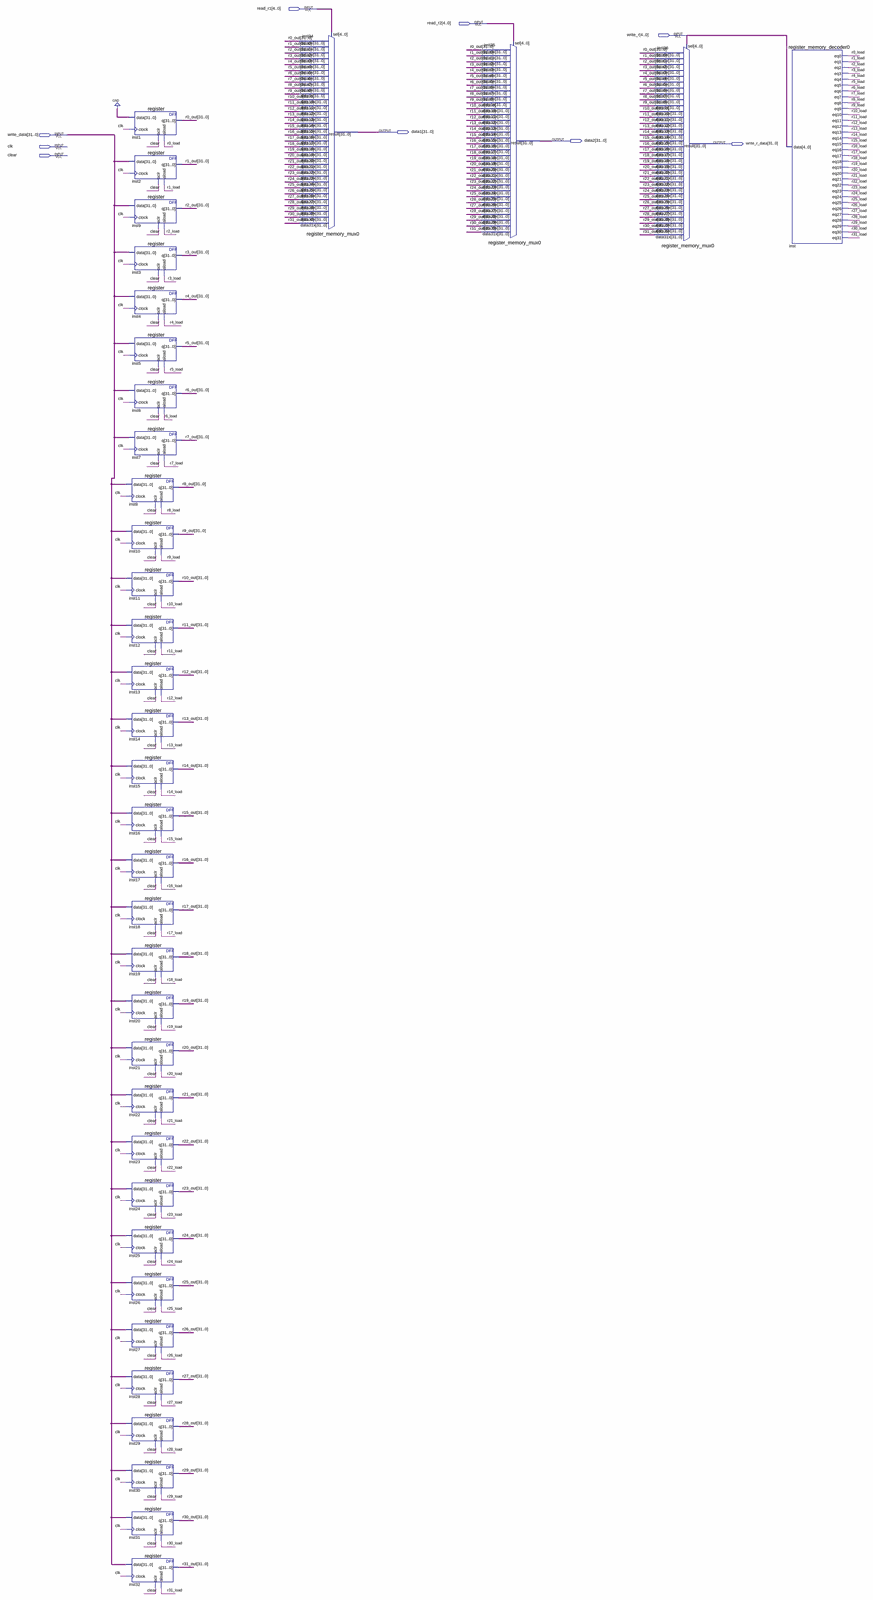
[diagram p0: schematic sheet, whole]
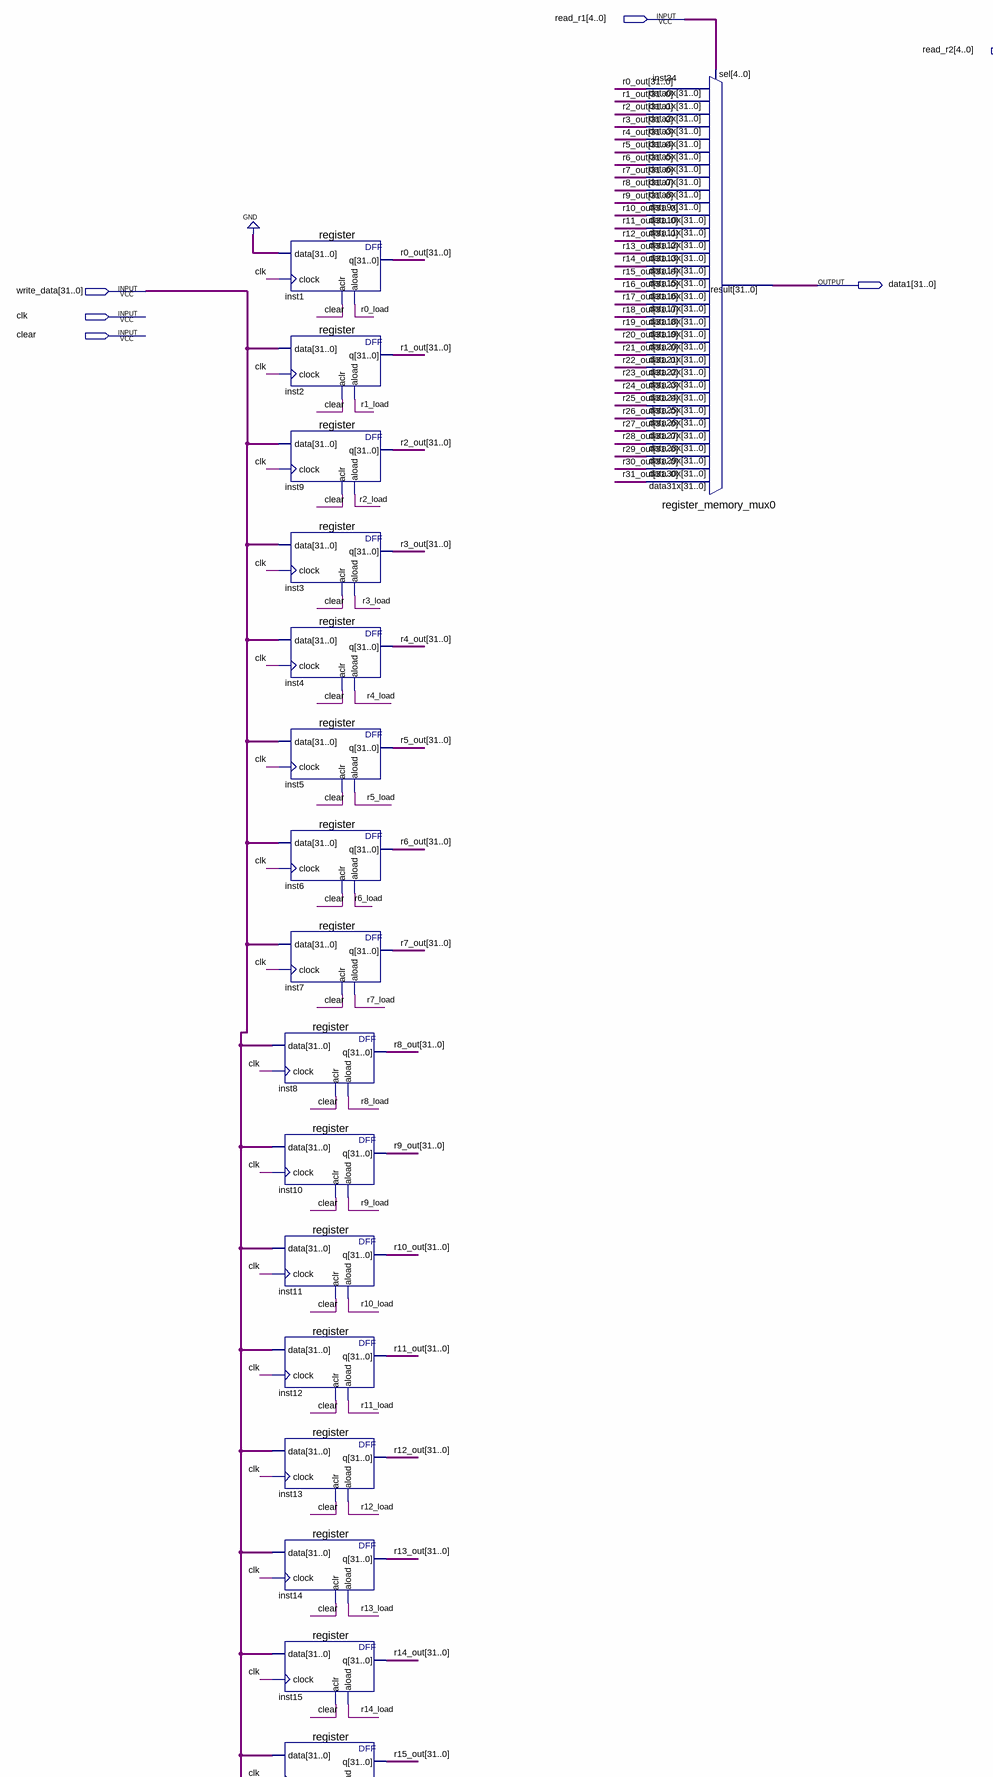
[diagram p1: schematic sheet, upper left part]
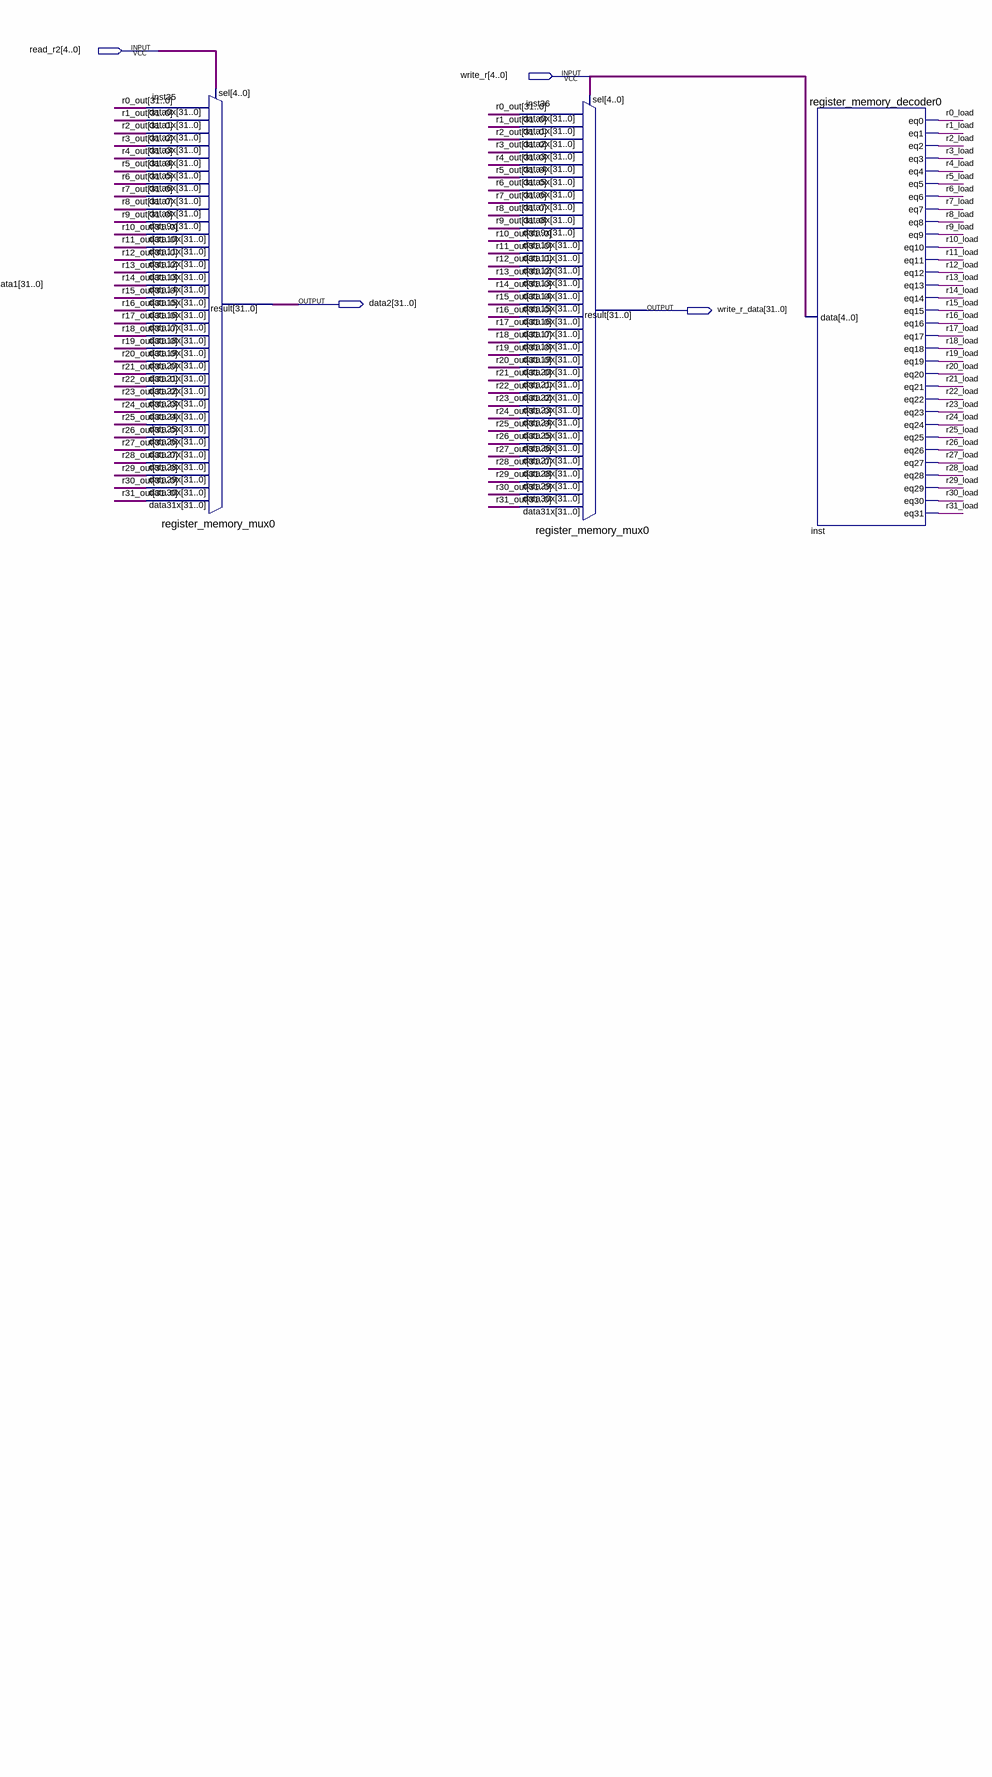
[diagram p2: schematic sheet, upper right part]
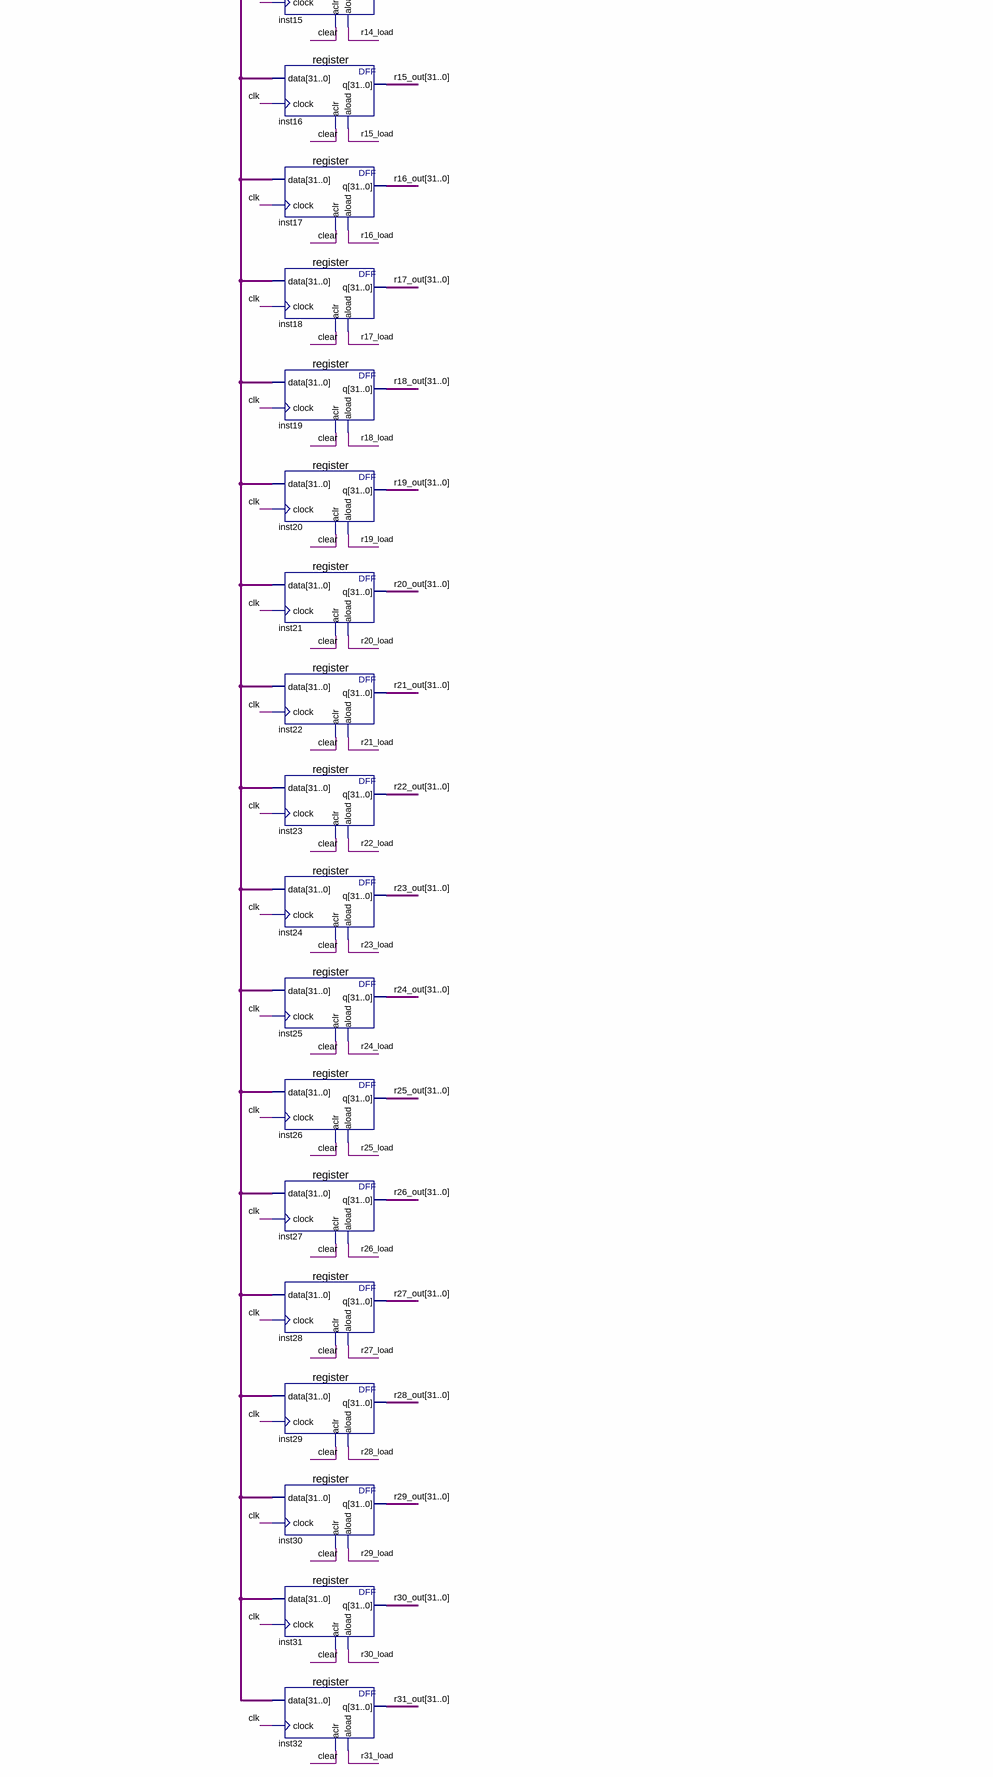
[diagram p3: schematic sheet, lower left part]
// Quartus schematic Register_Memory.bdf as structural Verilog: 36 symbols, 9 pins
module Register_Memory (
  input  [4:0] read_r1,
  input  [4:0] read_r2,
  input  [4:0] write_r,
  input  [31:0] write_data,
  input  clk,
  input  clear,
  output [31:0] data1,
  output [31:0] data2,
  output [31:0] write_r_data
);

  wire r0_load, r1_load, r2_load, r3_load, r4_load, r5_load, r6_load, r7_load, r8_load, r9_load, r10_load,
       r11_load, r12_load, r13_load, r14_load, r15_load, r16_load, r17_load, r18_load, r19_load, r20_load,
       r21_load, r22_load, r23_load, r24_load, r25_load, r26_load, r27_load, r28_load, r29_load, r30_load,
       r31_load;
  wire [31:0] r0_out, r1_out, r2_out, r3_out, r4_out, r5_out, r6_out, r7_out, r8_out, r9_out, r10_out,
       r11_out, r12_out, r13_out, r14_out, r15_out, r16_out, r17_out, r18_out, r19_out, r20_out, r21_out,
       r22_out, r23_out, r24_out, r25_out, r26_out, r27_out, r28_out, r29_out, r30_out, r31_out;

  register inst1 (.data({32{1'b0}}), .clock(clk), .aclr(clear), .aload(r0_load), .q(r0_out));
  register inst2 (.data(write_data), .clock(clk), .aclr(clear), .aload(r1_load), .q(r1_out));
  register inst9 (.data(write_data), .clock(clk), .aclr(clear), .aload(r2_load), .q(r2_out));
  register inst3 (.data(write_data), .clock(clk), .aclr(clear), .aload(r3_load), .q(r3_out));
  register inst4 (.data(write_data), .clock(clk), .aclr(clear), .aload(r4_load), .q(r4_out));
  register inst5 (.data(write_data), .clock(clk), .aclr(clear), .aload(r5_load), .q(r5_out));
  register inst6 (.data(write_data), .clock(clk), .aclr(clear), .aload(r6_load), .q(r6_out));
  register inst7 (.data(write_data), .clock(clk), .aclr(clear), .aload(r7_load), .q(r7_out));
  register inst8 (.data(write_data), .clock(clk), .aclr(clear), .aload(r8_load), .q(r8_out));
  register inst10 (.data(write_data), .clock(clk), .aclr(clear), .aload(r9_load), .q(r9_out));
  register inst11 (.data(write_data), .clock(clk), .aclr(clear), .aload(r10_load), .q(r10_out));
  register inst12 (.data(write_data), .clock(clk), .aclr(clear), .aload(r11_load), .q(r11_out));
  register inst13 (.data(write_data), .clock(clk), .aclr(clear), .aload(r12_load), .q(r12_out));
  register inst14 (.data(write_data), .clock(clk), .aclr(clear), .aload(r13_load), .q(r13_out));
  register inst15 (.data(write_data), .clock(clk), .aclr(clear), .aload(r14_load), .q(r14_out));
  register inst16 (.data(write_data), .clock(clk), .aclr(clear), .aload(r15_load), .q(r15_out));
  register inst17 (.data(write_data), .clock(clk), .aclr(clear), .aload(r16_load), .q(r16_out));
  register inst18 (.data(write_data), .clock(clk), .aclr(clear), .aload(r17_load), .q(r17_out));
  register inst19 (.data(write_data), .clock(clk), .aclr(clear), .aload(r18_load), .q(r18_out));
  register inst20 (.data(write_data), .clock(clk), .aclr(clear), .aload(r19_load), .q(r19_out));
  register inst21 (.data(write_data), .clock(clk), .aclr(clear), .aload(r20_load), .q(r20_out));
  register inst22 (.data(write_data), .clock(clk), .aclr(clear), .aload(r21_load), .q(r21_out));
  register inst23 (.data(write_data), .clock(clk), .aclr(clear), .aload(r22_load), .q(r22_out));
  register inst24 (.data(write_data), .clock(clk), .aclr(clear), .aload(r23_load), .q(r23_out));
  register inst25 (.data(write_data), .clock(clk), .aclr(clear), .aload(r24_load), .q(r24_out));
  register inst26 (.data(write_data), .clock(clk), .aclr(clear), .aload(r25_load), .q(r25_out));
  register inst27 (.data(write_data), .clock(clk), .aclr(clear), .aload(r26_load), .q(r26_out));
  register inst28 (.data(write_data), .clock(clk), .aclr(clear), .aload(r27_load), .q(r27_out));
  register inst29 (.data(write_data), .clock(clk), .aclr(clear), .aload(r28_load), .q(r28_out));
  register inst30 (.data(write_data), .clock(clk), .aclr(clear), .aload(r29_load), .q(r29_out));
  register inst31 (.data(write_data), .clock(clk), .aclr(clear), .aload(r30_load), .q(r30_out));
  register inst32 (.data(write_data), .clock(clk), .aclr(clear), .aload(r31_load), .q(r31_out));
  register_memory_mux0 inst34 (
    .data31x(r31_out), .data30x(r30_out), .data29x(r29_out), .data28x(r28_out), .data27x(r27_out),
    .data26x(r26_out), .data25x(r25_out), .data24x(r24_out), .data23x(r23_out), .data22x(r22_out),
    .data21x(r21_out), .data20x(r20_out), .data19x(r19_out), .data18x(r18_out), .data17x(r17_out),
    .data16x(r16_out), .data15x(r15_out), .data14x(r14_out), .data13x(r13_out), .data12x(r12_out),
    .data11x(r11_out), .data10x(r10_out), .data9x(r9_out), .data8x(r8_out), .data7x(r7_out), .data6x(r6_out),
    .data5x(r5_out), .data4x(r4_out), .data3x(r3_out), .data2x(r2_out), .data1x(r1_out), .data0x(r0_out),
    .sel(read_r1), .result(data1));
  register_memory_mux0 inst35 (
    .data31x(r31_out), .data30x(r30_out), .data29x(r29_out), .data28x(r28_out), .data27x(r27_out),
    .data26x(r26_out), .data25x(r25_out), .data24x(r24_out), .data23x(r23_out), .data22x(r22_out),
    .data21x(r21_out), .data20x(r20_out), .data19x(r19_out), .data18x(r18_out), .data17x(r17_out),
    .data16x(r16_out), .data15x(r15_out), .data14x(r14_out), .data13x(r13_out), .data12x(r12_out),
    .data11x(r11_out), .data10x(r10_out), .data9x(r9_out), .data8x(r8_out), .data7x(r7_out), .data6x(r6_out),
    .data5x(r5_out), .data4x(r4_out), .data3x(r3_out), .data2x(r2_out), .data1x(r1_out), .data0x(r0_out),
    .sel(read_r2), .result(data2));
  register_memory_mux0 inst36 (
    .data31x(r31_out), .data30x(r30_out), .data29x(r29_out), .data28x(r28_out), .data27x(r27_out),
    .data26x(r26_out), .data25x(r25_out), .data24x(r24_out), .data23x(r23_out), .data22x(r22_out),
    .data21x(r21_out), .data20x(r20_out), .data19x(r19_out), .data18x(r18_out), .data17x(r17_out),
    .data16x(r16_out), .data15x(r15_out), .data14x(r14_out), .data13x(r13_out), .data12x(r12_out),
    .data11x(r11_out), .data10x(r10_out), .data9x(r9_out), .data8x(r8_out), .data7x(r7_out), .data6x(r6_out),
    .data5x(r5_out), .data4x(r4_out), .data3x(r3_out), .data2x(r2_out), .data1x(r1_out), .data0x(r0_out),
    .sel(write_r), .result(write_r_data));
  register_memory_decoder0 inst (
    .data(write_r), .eq0(r0_load), .eq1(r1_load), .eq2(r2_load), .eq3(r3_load), .eq4(r4_load), .eq5(r5_load),
    .eq6(r6_load), .eq7(r7_load), .eq8(r8_load), .eq9(r9_load), .eq10(r10_load), .eq11(r11_load),
    .eq12(r12_load), .eq13(r13_load), .eq14(r14_load), .eq15(r15_load), .eq16(r16_load), .eq17(r17_load),
    .eq18(r18_load), .eq19(r19_load), .eq20(r20_load), .eq21(r21_load), .eq22(r22_load), .eq23(r23_load),
    .eq24(r24_load), .eq25(r25_load), .eq26(r26_load), .eq27(r27_load), .eq28(r28_load), .eq29(r29_load),
    .eq30(r30_load), .eq31(r31_load));
endmodule
